# EAGLE design Power_Distribution_V1.1 (EAGLE 9.6.2)
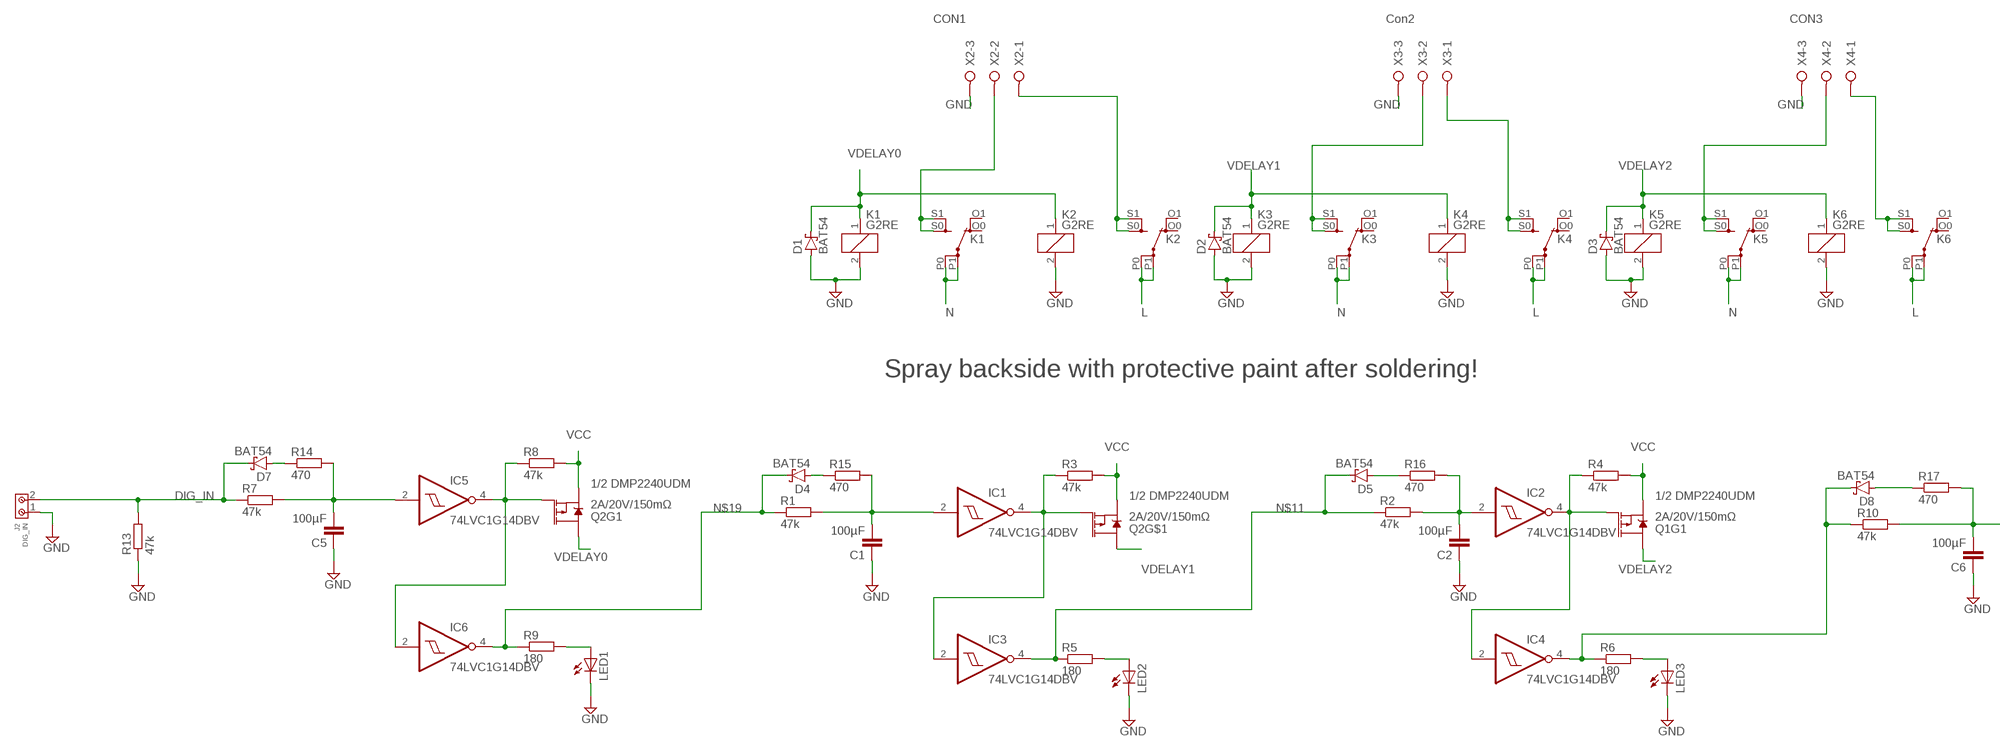
[diagram p0: schematic, sheet 1, part 1 of 2]
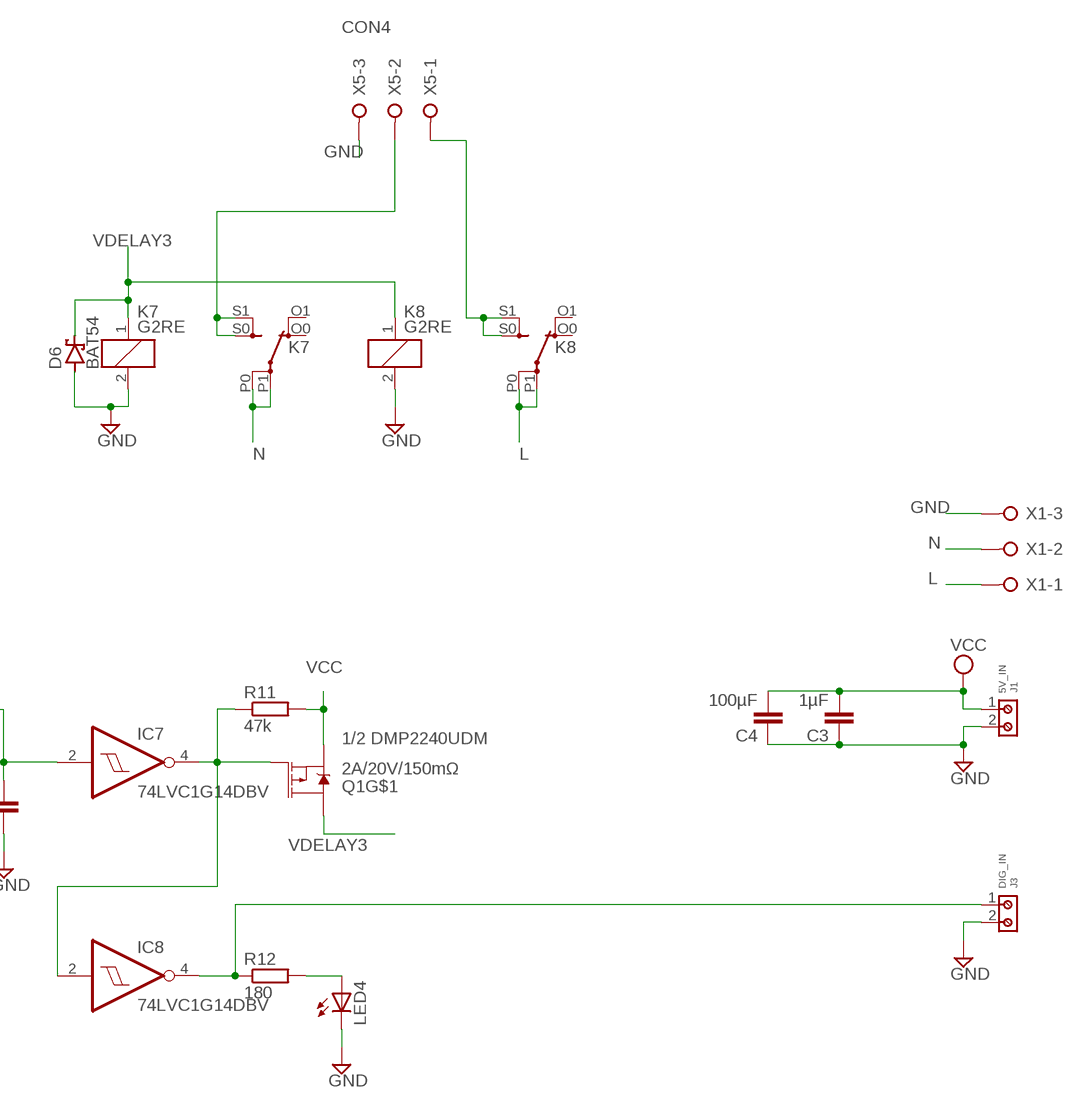
[diagram p1: schematic, sheet 1, part 2 of 2]

## Parts
C1  100µF  C-EUC1210  [C1210]
C2  100µF  C-EUC1210  [C1210]
C3  1µF  C-EUC1210  [C1210]
C4  100µF  C-EUC1210  [C1210]
C5  100µF  C-EUC1210  [C1210]
C6  100µF  C-EUC1210  [C1210]
D1  BAT54  [SOT23]
D2  BAT54  [SOT23]
D3  BAT54  [SOT23]
D4  BAT54  [SOT23]
D5  BAT54  [SOT23]
D6  BAT54  [SOT23]
D7  BAT54  [SOT23]
D8  BAT54  [SOT23]
IC1  74LVC1G14DBV  [SOT23-5]
IC2  74LVC1G14DBV  [SOT23-5]
IC3  74LVC1G14DBV  [SOT23-5]
IC4  74LVC1G14DBV  [SOT23-5]
IC5  74LVC1G14DBV  [SOT23-5]
IC6  74LVC1G14DBV  [SOT23-5]
IC7  74LVC1G14DBV  [SOT23-5]
IC8  74LVC1G14DBV  [SOT23-5]
J1  5V_IN  691210910002  [691210910002]
J2  DIG_IN  691210910002  [691210910002]
J3  DIG_IN  691210910002  [691210910002]
K1  G2RE  [G2RE]
K2  G2RE  [G2RE]
K3  G2RE  [G2RE]
K4  G2RE  [G2RE]
K5  G2RE  [G2RE]
K6  G2RE  [G2RE]
K7  G2RE  [G2RE]
K8  G2RE  [G2RE]
LED1  LED3MM  [LED3MM]
LED2  LED3MM  [LED3MM]
LED3  LED3MM  [LED3MM]
LED4  LED3MM  [LED3MM]
Q1  2A/20V/150mΩ  MOSFET_PCH_DUAL-DMP2240UDM  [SOT26]
Q2  2A/20V/150mΩ  MOSFET_PCH_DUAL-DMP2240UDM  [SOT26]
R1  47k  R-EU_R0805  [R0805]
R2  47k  R-EU_R0805  [R0805]
R3  47k  R-EU_R0805  [R0805]
R4  47k  R-EU_R0805  [R0805]
R5  180  R-EU_R0805  [R0805]
R6  180  R-EU_R0805  [R0805]
R7  47k  R-EU_R0805  [R0805]
R8  47k  R-EU_R0805  [R0805]
R9  180  R-EU_R0805  [R0805]
R10  47k  R-EU_R0805  [R0805]
R11  47k  R-EU_R0805  [R0805]
R12  180  R-EU_R0805  [R0805]
R13  47k  R-EU_R0805  [R0805]
R14  470  R-EU_R0805  [R0805]
R15  470  R-EU_R0805  [R0805]
R16  470  R-EU_R0805  [R0805]
R17  470  R-EU_R0805  [R0805]
X1  W237-3E  [W237-3E]
X2  W237-3E  [W237-3E]
X3  W237-3E  [W237-3E]
X4  W237-3E  [W237-3E]
X5  W237-3E  [W237-3E]

## Nets
DIG_IN: D7.3(C) J2.2 R7.1 R13.2
GND: C1.1 C2.1 C3.1 C4.1 C5.1 C6.1 D1.1(A) D2.1(A) D3.1(A) D6.1(A) J1.2 J2.1 J3.2 K1.2 K2.2 K3.2 K4.2 K5.2 K6.2 K7.2 K8.2 LED1.K(C) LED2.K(C) LED3.K(C) LED4.K(C) R13.1 X1.3 X2.3 X3.3 X4.3 X5.3
L: K2.P0(2:P) K2.P1(2:P) K4.P0(2:P) K4.P1(2:P) K6.P0(2:P) K6.P1(2:P) K8.P0(2:P) K8.P1(2:P) X1.1
N: K1.P0(2:P) K1.P1(2:P) K3.P0(2:P) K3.P1(2:P) K5.P0(2:P) K5.P1(2:P) K7.P0(2:P) K7.P1(2:P) X1.2
N$1: K1.S0(2:S) K1.S1(2:S) X2.2
N$2: K2.S0(2:S) K2.S1(2:S) X2.1
N$3: K3.S0(2:S) K3.S1(2:S) X3.2
N$4: K4.S0(2:S) K4.S1(2:S) X3.1
N$5: K5.S0(2:S) K5.S1(2:S) X4.2
N$6: K6.S0(2:S) K6.S1(2:S) X4.1
N$7: IC1.4(O) IC3.2(I) Q2.G2(G) R3.1
N$8: IC2.4(O) IC4.2(I) Q1.G1(G) R4.1
N$9: C2.2 IC2.2(I) R2.2 R16.2
N$10: C1.2 IC1.2(I) R1.2 R15.2
N$11: D5.3(C) IC3.4(O) R2.1 R5.1
N$12: LED2.A R5.2
N$13: D8.3(C) IC4.4(O) R6.1 R10.1
N$14: LED3.A R6.2
N$15: K7.S0(2:S) K7.S1(2:S) X5.2
N$16: K8.S0(2:S) K8.S1(2:S) X5.1
N$17: IC5.4(O) IC6.2(I) Q2.G1(G) R8.1
N$18: C5.2 IC5.2(I) R7.2 R14.2
N$19: D4.3(C) IC6.4(O) R1.1 R9.1
N$20: LED1.A R9.2
N$21: IC7.4(O) IC8.2(I) Q1.G2(G) R11.1
N$22: C6.2 IC7.2(I) R10.2 R17.2
N$23: IC8.4(O) J3.1 R12.1
N$24: LED4.A R12.2
N$25: D7.1(A) R14.1
N$26: D4.1(A) R15.1
N$27: D5.1(A) R16.1
N$28: D8.1(A) R17.1
VCC: C3.2 C4.2 J1.1 Q1.S1(S) Q1.S2(S) Q2.S1(S) Q2.S2(S) R3.2 R4.2 R8.2 R11.2
VDELAY0: D1.3(C) K1.1 K2.1 Q2.D1(D)
VDELAY1: D2.3(C) K3.1 K4.1 Q2.D2(D)
VDELAY2: D3.3(C) K5.1 K6.1 Q1.D1(D)
VDELAY3: D6.3(C) K7.1 K8.1 Q1.D2(D)
Unconnected: K1.O0(2:O) K1.O1(2:O) K2.O0(2:O) K2.O1(2:O) K3.O0(2:O) K3.O1(2:O) K4.O0(2:O) K4.O1(2:O) K5.O0(2:O) K5.O1(2:O) K6.O0(2:O) K6.O1(2:O) K7.O0(2:O) K7.O1(2:O) K8.O0(2:O) K8.O1(2:O)

## Notes on the sheet
- CON1 | Con2 | CON3 | CON4
- Spray backside with protective paint after soldering!
- 1/2 DMP2240UDM
- 1/2 DMP2240UDM | 1/2 DMP2240UDM
- 1/2 DMP2240UDM

## Power pins joined to a net without a drawn wire
GND: IC1.3(GND) IC2.3(GND) IC3.3(GND) IC4.3(GND) IC5.3(GND) IC6.3(GND) IC7.3(GND) IC8.3(GND)
VCC: IC1.5(VCC) IC2.5(VCC) IC3.5(VCC) IC4.5(VCC) IC5.5(VCC) IC6.5(VCC) IC7.5(VCC) IC8.5(VCC)

## Library data of the parts
C1-C6 = rcl:C-EU: CAPACITOR, European symbol; SPICEPREFIX: C
D1-D8 = diode:BAT54: Schottky Diodes Source: Fairchild .. BAT54.pdf
IC1-IC8 = 74xx-little-us:74*1G14: Single Schmitt-Trigger Inverter Gate
J1-J3 = Wurth_Connectors_WR-TBL Rising Cage Clamp:691210910002: WR-TBL Serie 2109 - 2.54 mm Horiz. Entry KIND PROPERTIES Pitch 2.54 mm MATERIAL PROPERTIES Insulator Material PA66 Insulator Flammability Rating UL94 V-0 Insulator Color Green Contact Material Brass Contact Plating Copper over Zinc Terminal Screw Material Steel Terminal Screw Plating Zinc Wire Guard Material Brass GENERAL INFORMATION Operating Temperature -40 up to +105 °C Compliance Lead free / RoHS ELECTRICAL PROPERTIES IR cULus 6 A Working Voltage [cULus] 150 V (AC) Withstanding Voltage [cULus] 1300 V (AC) Contact Resistance [cULus] 20 mΩ MECHANICAL PROPERTIES Wire Strip Length 4 up to 5 (mm) Screw M1.6 Solid Wire Section (AWG) 30 to 18 (AWG) Solid Wire Section (Metric) 0.0509 to 0.823 (mm²) Stranded Wire Section (AWG) 30 to 18 (AWG) Stranded Wire Section (Metric) 0.0509 to 0.823 (mm²) CERTIFICATION cULus Approval E315414 PACKAGING PROPERTIES Packaging Box <https://katalog.we-online.com/media/images/v2/o33231v209%20Family_WR-TBL_69121091000x.jpg> Details see: https://katalog.we-online.com/en/em/TBL_2_54_2109_HORIZONTAL_ENTRY_69121091000X Updated by Ella Wu 2019-11-12 2019(C) Wurth Elektronik; DATASHEET-URL: https://www.we-online.com/catalog/datasheet/691210910002.pdf; IR-UL: 6A; MOUNT: THT; PART-NUMBER: 691210910002; PINS: 2; PITCH: 2.54mm; TYPE: Horizontal; WIRE: 30 to 18 (AWG) 0.0509 to 0.823 (mm²); WORKING-VOLTAGE-UL: 150V (AC)
K1-K8 = relay:G2RE: RELAY 1 x switch, high current, Omron; OC_FARNELL: unknown; OC_NEWARK: unknown
LED1-LED4 = adafruit:LED: LED OSRAM: - CHIPLED LG R971, LG N971, LY N971, LG Q971, LY Q971, LO R971, LY R971 LH N974, LH R974 LS Q976, LO Q976, LY Q976 LO Q996 - Hyper CHIPLED LW Q18S LB Q993, LB Q99A, LB R99A - SideLED LS A670, LO A670, LY A670, LG A670, LP A670 LB A673, LV A673, LT A673, LW A673 LH A674 LY A675 LS A676, LA A676, LO A676, LY A676, LW A676 LS A679, LY A679, LG A679 - Hyper Micro SIDELED® LS Y876, LA Y876, LO Y876, LY Y876 LT Y87S - SmartLED LW L88C, LW L88S LB L89C, LB L89S, LG L890 LS L89K, LO L89K, LY L89K LS L896, LA L896, LO L896, LY L896 - TOPLED LS T670, LO T670, LY T670, LG T670, LP T670 LSG T670, LSP T670, LSY T670, LOP T670, LYG T670 LG T671, LOG T671, LSG T671 LB T673, LV T673, LT T673, LW T673 LH T674 LS T676, LA T676, LO T676, LY T676, LB T676, LH T676, LSB T676, LW T676 LB T67C, LV T67C, LT T67C, LS T67K, LO T67K, LY T67K, LW E67C LS E67B, LA E67B, LO E67B, LY E67B, LB E67C, LV E67C, LT E67C LW T67C LS T679, LY T679, LG T679 LS T770, LO T770, LY T770, LG T770, LP T770 LB T773, LV T773, LT T773, LW T773 LH T774 LS E675, LA E675, LY E675, LS T675 LS T776, LA T776, LO T776, LY T776, LB T776 LHGB T686 LT T68C, LB T68C - Hyper Mini TOPLED® LB M676 - Mini TOPLED Santana® LG M470 LS M47K, LO M47K, LY M47K Source: http://www.osram.convergy.de/
Q1 Q2 = SparkFun-DiscreteSemi:MOSFET_PCH_DUAL: Dual P-Channel -20VDS MOSFET Link to datasheet <http://www.diodes.com/_files/datasheets/ds31197.pdf> SparkFun Products: SparkFun FreeSoC2 Development Board <https://www.sparkfun.com/products/13229>; PROD_ID: TRANS-12444
R1-R17 = rcl:R-EU_: RESISTOR, European symbol; SPICEPREFIX: R
X1-X5 = con-wago-508:W237-3E: WAGO SREW CLAMP; OC_FARNELL: unknown; OC_NEWARK: unknown

## Board
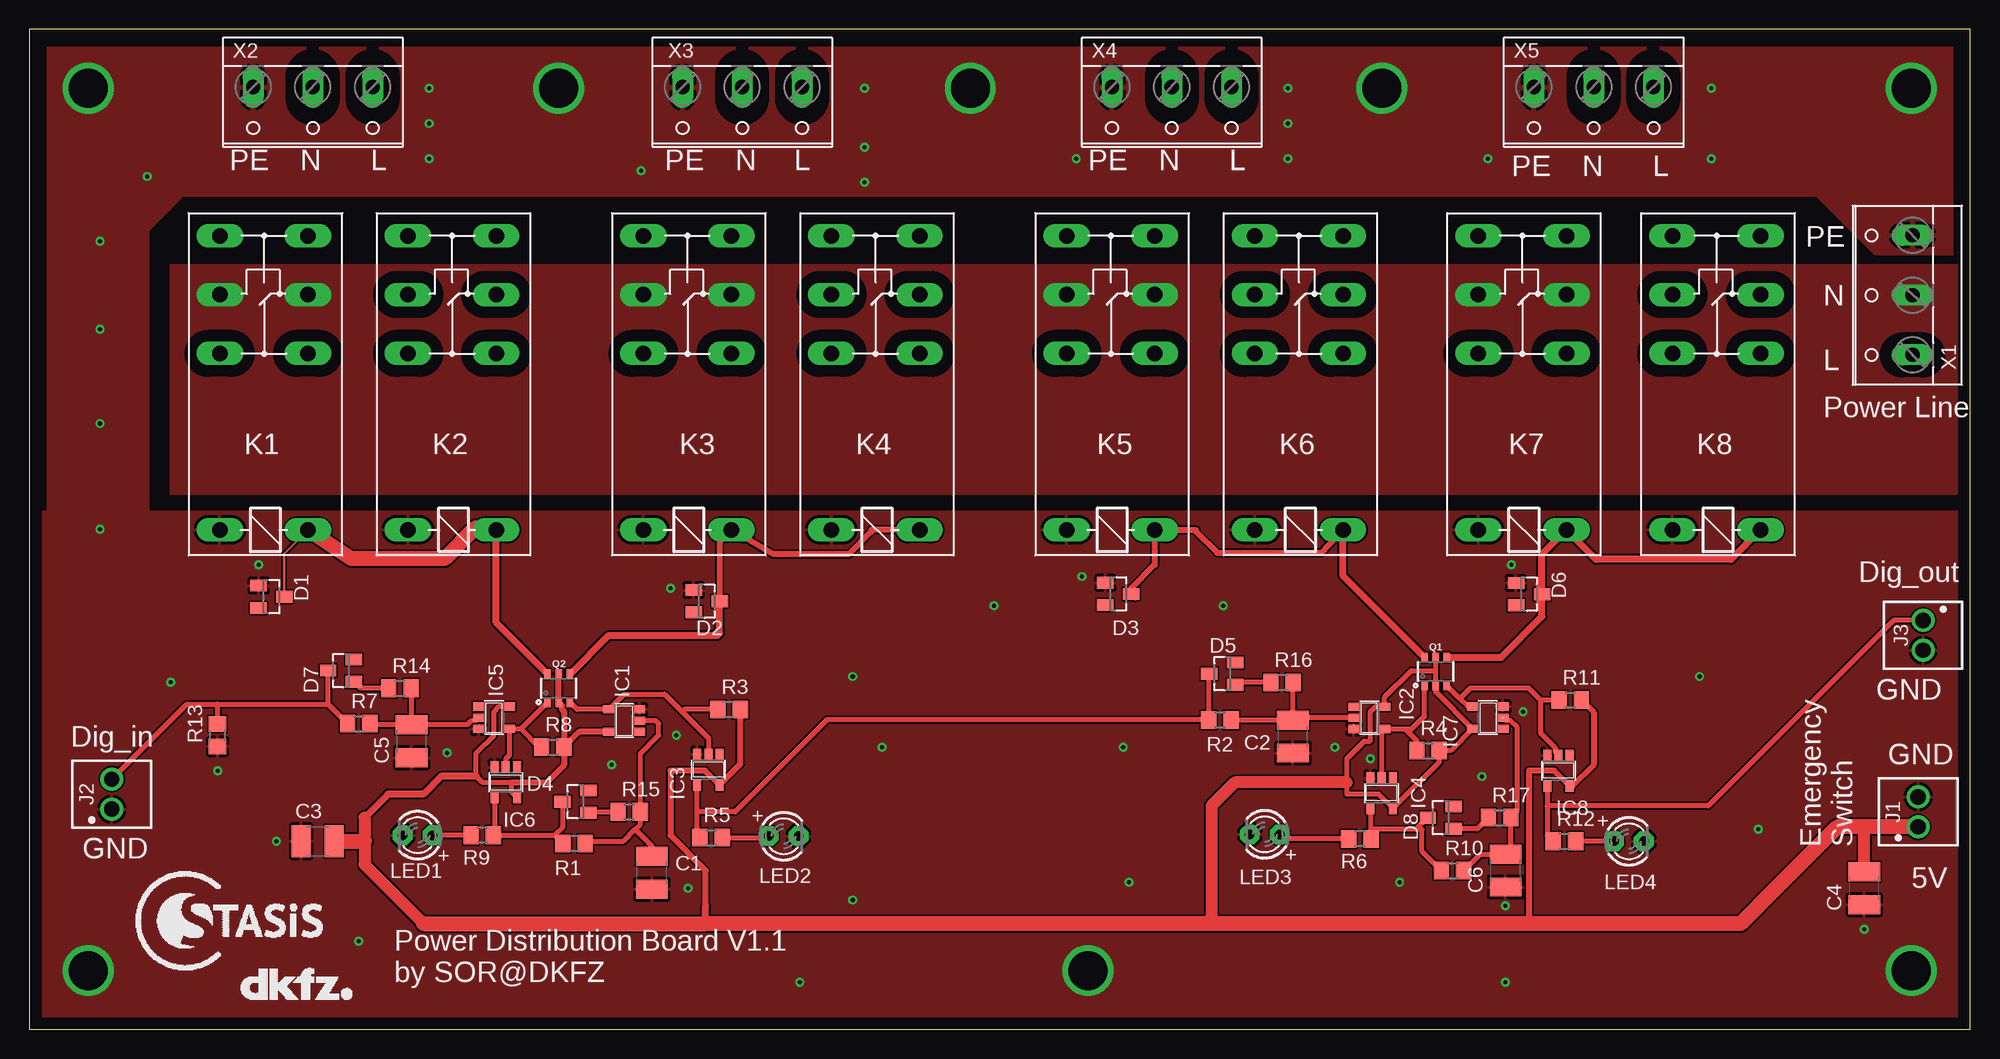
[diagram p2: board, top side]
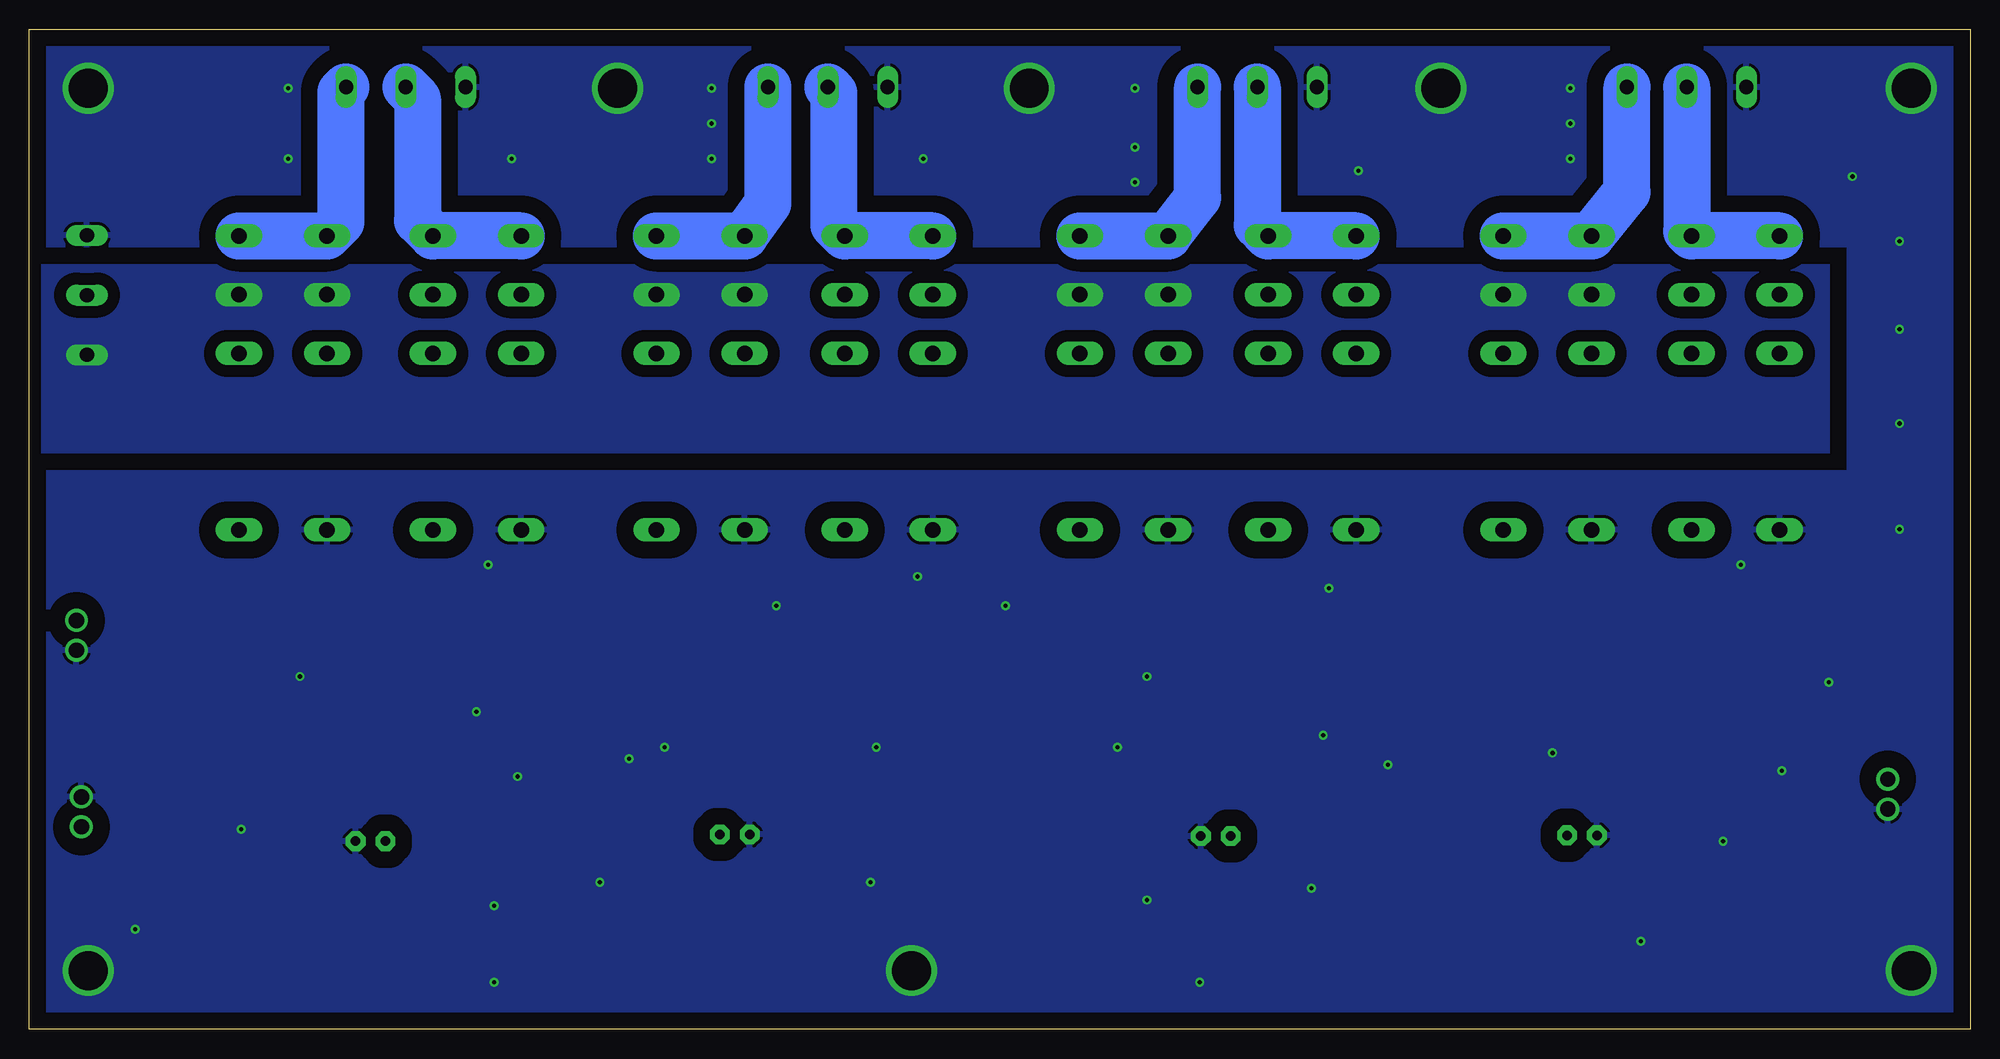
[diagram p3: board, bottom side, seen from below]

Size 165 x 85 mm. Coordinates in mm from the lower left corner, seen from the top.
Outline: 0,0 165,0 165,85 0,85 0,0
Copper layers (1*16): Top 0.035mm / dielectric 1.5mm / Bottom 0.035mm
Design rules "default": minimum track width 6mil, minimum drill 0.35mm, track to track 6mil, track to pad 6mil, pad to pad 6mil, via to via 6mil, smd to smd 6mil, copper to edge 40mil, drill to drill 6mil, minimum pad ring 10mil, minimum via ring 8mil, stop-mask expansion 4mil, vias tented up to drill 0mil, thermal gap 10mil

### Footprints (pad centres in the part's own frame; a part is rotated, then mirrored left to right if it is on the bottom)
C1210 = smd 1.6 x 2.7: 1 -1.4,0; 2 1.4,0
SOT23 = smd 1 x 1.4: 1 -0.95,-1.1; 2 0.95,-1.1; 3 0,1.1
SOT23-5 = smd 0.69 x 0.99: 1 -0.95,-1.29; 2 0,-1.29; 3 0.95,-1.29; 4 0.95,1.3; 5 -0.95,1.3
691210910002 = drill 1.3: 1 -1.27,0; 2 1.27,0
G2RE = drill 1.321 long: 1 -2.54,-3.683; 2 -2.54,3.81; O0 12.471,-3.683; O1 12.471,3.81; P0 17.45,-3.683; P1 17.45,3.81; S0 22.454,-3.683; S1 22.454,3.81
LED3MM = drill 0.813 pad 1.676 octagon: A -1.27,0; K 1.27,0
SOT26 = smd 0.55 x 0.8: D1 -0.95,1.2; D2 0.95,1.2; G1 -0.95,-1.2; G2 0.95,-1.2; S1 0,1.2; S2 0,-1.2
R0805 = smd 1.3 x 1.5: 1 -0.95,0; 2 0.95,0
W237-3E = drill 1.194 long: 1 -5.08,-0.635; 2 0,-0.635; 3 5.08,-0.635

### Placement (x,y rotation side)
C1  52.92,13.31 90 top
C2  107.42,24.89 90 top
C3  24.5,16 0 top
C4  156,12 90 top
C5  32.5,24.5 90 top
C6  125.5,13.5 90 top
D1  20.58,36.78 270 top
D2  57.58,36.4 270 top
D3  92.58,37.02 270 top
D4  46.42,19.36 90 top
D5  101.42,30.24 90 top
D6  127.5,37 270 top
D7  26.5,30.5 90 top
D8  120,18 90 top
IC1  50.58,26.25 90 top
IC2  113.92,26.49 270 top
IC3  57.73,22.08 180 top
IC4  114.97,20.08 180 top
IC5  39.5,26.5 270 top
IC6  40.5,21 180 top
IC7  124,26.5 90 top
IC8  130,22 180 top
J1  160.58,18.49 90 top
J2  7,20 90 top
J3  161,33.5 270 top
K1  20,45 90 top
K2  36,45 90 top
K3  56,45 90 top
K4  72,45 90 top
K5  92,45 90 top
K6  108,45 90 top
K7  127,45 90 top
K8  143.5,45 90 top
LED1  33,16.5 180 top
LED2  64.13,16.43 0 top
LED3  105.03,16.57 180 top
LED4  136,16 0 top
Q1  119.56,30.43 0 top
Q2  45,29 0 top
R1  46.3,15.81 0 top
R2  101.22,26.31 0 top
R3  59.49,27.2 0 top
R4  118.91,23.7 0 top
R5  57.96,16.31 0 top
R6  113.12,16.19 180 top
R7  28,26 0 top
R8  44.5,24 0 top
R9  38.5,16.5 180 top
R10  121,13.5 0 top
R11  131,28 0 top
R12  130.5,16 0 top
R13  16,25 90 top
R14  31.5,29 0 top
R15  51,18.5 0 top
R16  106.5,29.5 0 top
R17  125,18 0 top
U$1  [LOGO_STASIS]  18,9 0 top
U$2  [LOGO_DKFZ]  18,2.5 0 top
X1  159.47,62.41 90 top
X2  24.1,79.47 180 top
X3  60.61,79.47 180 top
X4  97.12,79.47 180 top
X5  133,79.47 180 top

### Tracks (layer width: path | path; a pad name or v marks a point on that pad's centre or on a via)
DIG_IN
  Top 0.406: R7.1 25.4,27.65 | 25.4,27.65 D7.3 | J2.2 13.38,27.65 16,27.65 | 16,27.65 25.4,27.65 | R13.2 16,27.65
GND  (via drill 0.35, 3.3)
  other vias: 5,80 160,80 160,5 5,5 70,30 72.5,24 70,11 93.5,12.5 49.5,22.5 65.5,4 54.5,37.5 89.5,38.5 19.5,39.5 80,80 45,80 90,5 35.5,23.5 56,12 28,7.5 21,16 55,25 125.5,4 147,17 142,30 123.5,21.5 93,24 114,23 127,27 116.5,12.5 101.5,36 82,36 16,22 6,42.5 6,51.5 6,59.5 6,67 10,72.5 126,39.5 12,29.5 156,8.5 111,24 143,80 143,74 124,74 107,74 107,77 107,80 89,74 71,80 71,75 71,72 52,73 34,74 34,77 34,80 115,80 125.5,10.5
  pour Bottom (isolate 1.422, rank 2): 1,85 1,1 165,1 165,85
  pour Top: 165,44 1,44 1,1 165,1
  pour Top (isolate 1.422): 165,66 165,84 1,84 1,43 9,43 10,44 10,68 13,71 152,71 157,66
L
  pour Bottom (isolate 1.016, no thermals): 165,65 12,65 12,49 165,49
N
  pour Top (isolate 1.016, no thermals): 12,65 165,65 165,45.5 12,45.5
N$1
  Bottom 4: K1.S1 K1.S0 24.1,67.87 X2.2
N$2
  Bottom 4: K2.S0 K2.S1 29.18,71.18 X2.1
N$3
  Bottom 4: K3.S1 K3.S0 60.61,68.38 X3.2
N$4
  Bottom 4: K4.S0 K4.S1 65.69,70.7 X3.1
N$5
  Bottom 4: K5.S1 K5.S0 96.62,68.39 96.62,79.61 X4.2
N$6
  Bottom 4: K6.S0 K6.S1 102.2,70.22 X4.1
N$7
  Top 0.406: Q2.G2 46.55,27.2 IC1.4 50.58,28.5 54,28.5 55.5,27 | IC3.2 57.73,24.77 55.5,27 | R3.1 55.7,27.2 55.5,27
N$8
  Top 0.406: 117,25.5 117.5,25.5 118.61,26.61 Q1.G1 | 117,25.5 115.26,25.5 IC2.4 114.97,25.29 IC4.2 | R4.1 117.96,24.54 117,25.5
N$9
  Top 0.203: C2.2
  Top 0.406: IC2.2 107.62,26.49 C2.2 | C2.2 107.42,29.47 R16.2 | C2.2 102.19,26.29 R2.2
N$10
  Top 0.406: R1.2 47.44,16 50.5,16 51.5,17 | 51.5,17 51.95,17.45 R15.2 51.95,23.45 53.5,25 53.5,26 53.25,26.25 IC1.2 | C1.2 52.92,15.58 51.5,17
N$11
  Top 0.406: R5.1 56.78,16.54 56.78,18.5 | 56.78,18.5 IC3.4 | D5.3 100.27,30.19 R2.1 67.81,26.31 60,18.5 56.78,18.5
N$12
  Top 0.406: R5.2 62.74,16.31 LED2.A
N$13
  Top 0.406: IC4.4 114.02,17 | 114.02,17 114.02,16.24 R6.1 | D8.3 117.9,17 | 117.9,17 118.4,17 118.4,15.15 R10.1 | 117.9,17 114.02,17
N$14
  Top 0.406: R6.2 106.68,16.19 LED3.A
N$15
  Bottom 4: K7.S1 K7.S0 132,68.77 132,79.11 X5.2
N$16
  Bottom 4: K8.S0 K8.S1 138.5,68.64 138.5,79.69 X5.1
N$17
  Top 0.406: 41.8,25.55 IC5.4 40.8,23.3 40.5,23 IC6.2 | 41.8,25.55 Q2.G1 | R8.1 43.35,24 41.8,25.55
N$18
  Top 0.406: IC5.2 37.96,26.25 37.57,26.25 37.22,25.9 C5.2 | C5.2 29.05,25.9 R7.2 | C5.2 32.5,28.95 R14.2
N$19
  Top 0.406: IC6.4 39.55,16.6 R9.1 44.66,16.5 | 44.66,16.5 R1.1 | D4.3 45.32,17.16 44.66,16.5
N$20
  Top 0.406: R9.2 LED1.A
N$21
  Top 0.406: IC7.4 122.29,27.45 121.62,28.12 | 121.62,28.12 Q1.G2 | IC8.2 129.75,23.54 129.75,23.93 128.5,25.18 128.5,28 | 128.5,28 127.5,29 122.5,29 121.62,28.12 | R11.1 128.5,28
N$22
  Top 0.406: R10.2 123.35,14.9 C6.2 125.95,15.35 R17.2 126.45,18.5 126.45,25.73 125.93,26.25 125.54,26.25 IC7.2
N$23
  Top 0.406: IC8.4 129.05,19 | 129.05,19 129.05,16.5 R12.1 | J3.1 158.5,34.77 142.73,19 129.05,19
N$24
  Top 0.406: LED4.A R12.2
N$25
  Top 0.406: R14.1 28.15,29 D7.1
N$26
  Top 0.406: D4.1 47.61,18.5 R15.1
N$27
  Top 0.406: R16.1 102.73,29.5 D5.1
N$28
  Top 0.406: R17.1 123.1,17.05 D8.1
VCC
  Top 0.406: 148.42,12 148.5,12 | IC6.5 41,20.15 41,21 38.5,21 38,21.5 38,23.5 39.5,25 39.5,27 39.95,27.45 IC5.5 | 119.56,30.5 Q1.S2 119.56,28.69 IC7.5 120.85,23.7 R4.2 119.86,22.72 IC4.5 114.7,20 112,20 112,21 112,23 113.5,24.5 114,24.5 114,27 114.44,27.44 IC2.5 115.22,28.22 117.5,30.5 119.56,30.5 | 119.56,30.5 Q1.S1
  Top 0.508: IC1.5 46.75,25.3 R8.2 | 41,21 44,21 45.5,22.5 45.5,23.95 R8.2 | R3.2 60.44,22.54 IC3.5 57.46,22 54.5,22 54.5,16.5 57.5,13.5 57.5,10.5 | R11.2 133,26.95 133,22.5 131.2,20.7 IC8.5 129.65,22 127.5,22 127.5,9 | Q2.S1 Q2.S2 45.27,27.53 45.27,27.23 45.45,27.05 R8.2
  Top 0.61: 38,21.5 35,21.5 33.5,20 30.5,20 28.5,18 | 57.5,9 57.5,10.5
  Top 1.016: C4.2 156,17.22 | 28.5,18 28.5,16 28.5,14 33.5,9 | 112,21 102.5,21 100.5,19 100.5,9
  Top 1.27: J1.1 156,17.22 153.72,17.22 148.5,12 145.5,9 127.5,9 100.5,9 57.5,9 33.5,9 | C3.2 28.5,16
VDELAY0
  Top 0.203: D1.3 21.68,40.44 K1.1
  Top 0.61: Q2.D1 39.68,34.57 K2.1
  Top 1.27: K2.1 37.9,42.63 35.3,40.02 27.38,40.02 K1.1
VDELAY1
  Top 0.508: D2.3 58.68,41.41 K3.1 63.24,40.4 69.67,40.4 71.57,42.3 71.58,42.46 K4.1 77.11,41.78
  Top 0.61: Q2.D2 49.25,33.5 58.5,33.5 58.68,33.68 D2.3
VDELAY2
  Top 0.508: 94,36.7 D3.3 93.68,37.52 95.62,39.46 95.68,39.47 K5.1 99.17,42.46 99.18,42.32 101,40.5 109.86,40.5 K6.1
  Top 0.61: Q1.D1 111.68,38.56 K6.1
VDELAY3
  Top 0.61: K8.1 144.68,39.96 133.18,39.96 K7.1 128.6,40.38 D6.3 128.6,35.1 125.13,31.63 Q1.D2

### Text on the board
tPlace: PE | N | L | PE | N | L | PE | N | L | L | PE | N | L | PE | N | L | Power Line | Dig_out | GND | Dig_in | GND | Emergency / Switch | GND | 5V | Power Distribution Board V1.1 / by SOR@DKFZ